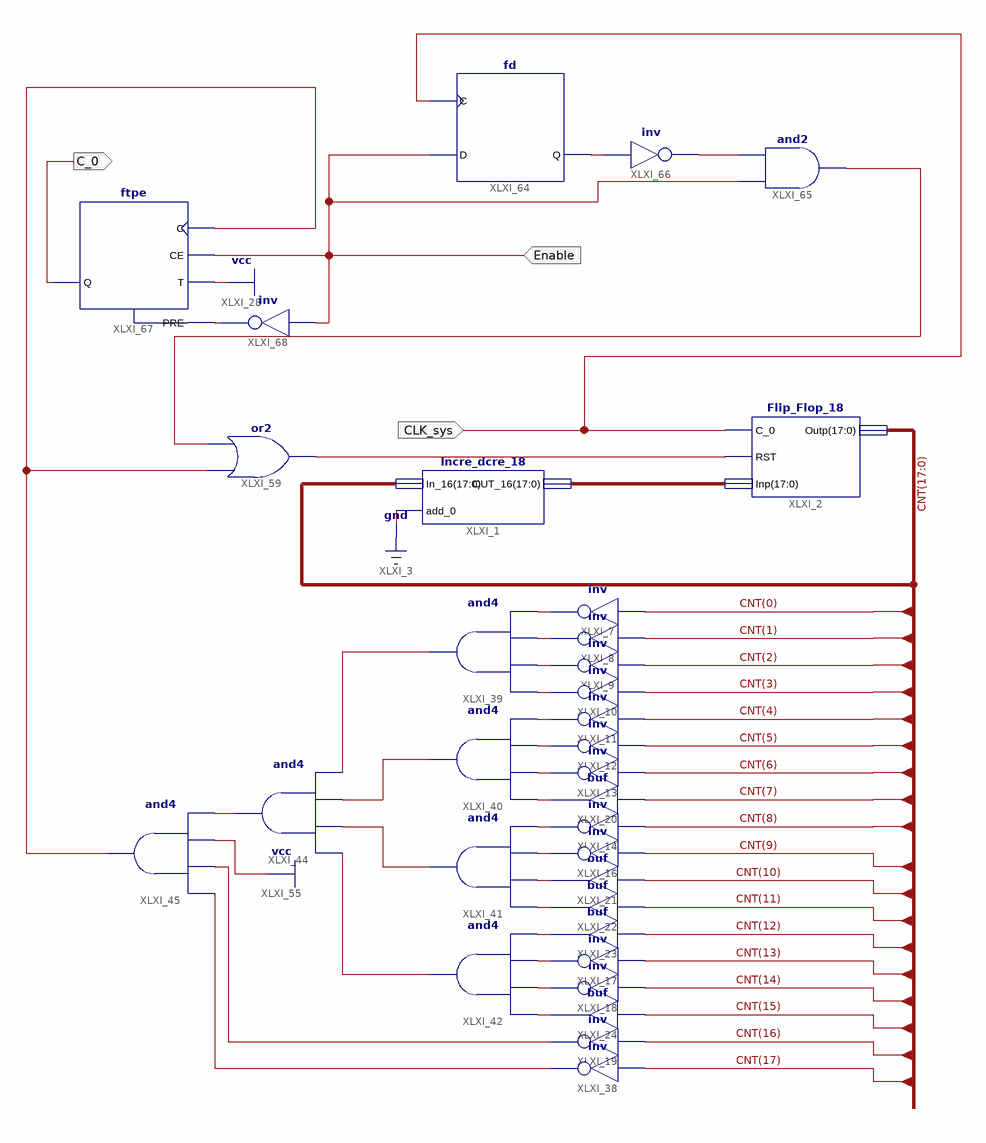
[diagram p0: schematic sheet 1]
// Xilinx ISE schematic Counter_18.sch (spartan3e) as structural Verilog: 32 symbols, 3 ports
module Counter_18 (
  input  Enable,
  input  CLK_sys,
  output C_0
);

  wire XLXN_10, XLXN_11, XLXN_12, XLXN_13, XLXN_14, XLXN_15, XLXN_16, XLXN_17, XLXN_18, XLXN_19, XLXN_20,
       XLXN_21, XLXN_22, XLXN_23, XLXN_24, XLXN_25, XLXN_26, XLXN_27, XLXN_64, XLXN_65, XLXN_66, XLXN_67,
       XLXN_68, XLXN_72, XLXN_79, XLXN_90, XLXN_93, XLXN_96, XLXN_99;
  wire [17:0] CNT, XLXN_1;

  Incre_dcre_18 XLXI_1 (.In_16(CNT), .add_0(1'b0), .OUT_16(XLXN_1));
  Flip_Flop_18 XLXI_2 (.C_0(CLK_sys), .RST(XLXN_79), .Inp(XLXN_1), .Outp(CNT));
  and XLXI_39 (XLXN_64, XLXN_11, XLXN_12, XLXN_13, XLXN_14);
  and XLXI_40 (XLXN_65, XLXN_15, XLXN_16, XLXN_17, XLXN_24);
  and XLXI_41 (XLXN_66, XLXN_18, XLXN_19, XLXN_20, XLXN_25);
  and XLXI_42 (XLXN_67, XLXN_26, XLXN_27, XLXN_21, XLXN_22);
  and XLXI_44 (XLXN_72, XLXN_64, XLXN_65, XLXN_66, XLXN_67);
  and XLXI_45 (XLXN_10, XLXN_72, 1'b1, XLXN_68, XLXN_23);
  not XLXI_8 (XLXN_12, CNT[1]);
  not XLXI_9 (XLXN_13, CNT[2]);
  not XLXI_10 (XLXN_14, CNT[3]);
  not XLXI_11 (XLXN_15, CNT[4]);
  not XLXI_12 (XLXN_16, CNT[5]);
  not XLXI_13 (XLXN_17, CNT[6]);
  not XLXI_14 (XLXN_18, CNT[8]);
  buf XLXI_20 (XLXN_24, CNT[7]);
  not XLXI_19 (XLXN_68, CNT[16]);
  not XLXI_18 (XLXN_21, CNT[14]);
  buf XLXI_24 (XLXN_22, CNT[15]);
  buf XLXI_23 (XLXN_26, CNT[12]);
  not XLXI_17 (XLXN_27, CNT[13]);
  buf XLXI_22 (XLXN_25, CNT[11]);
  buf XLXI_21 (XLXN_20, CNT[10]);
  not XLXI_16 (XLXN_19, CNT[9]);
  not XLXI_38 (XLXN_23, CNT[17]);
  not XLXI_7 (XLXN_11, CNT[0]);
  or XLXI_59 (XLXN_79, XLXN_10, XLXN_93);
  not XLXI_66 (XLXN_90, XLXN_96);
  fd XLXI_64 (.C(CLK_sys), .D(Enable), .Q(XLXN_96));
  and XLXI_65 (XLXN_93, Enable, XLXN_90);
  ftpe XLXI_67 (.C(XLXN_10), .CE(Enable), .PRE(XLXN_99), .T(1'b1), .Q(C_0));
  not XLXI_68 (XLXN_99, Enable);
endmodule
